# Altium schematic sheet Bank13.SchDoc
size A3; SheetNumber: 5; SheetTotal: 9
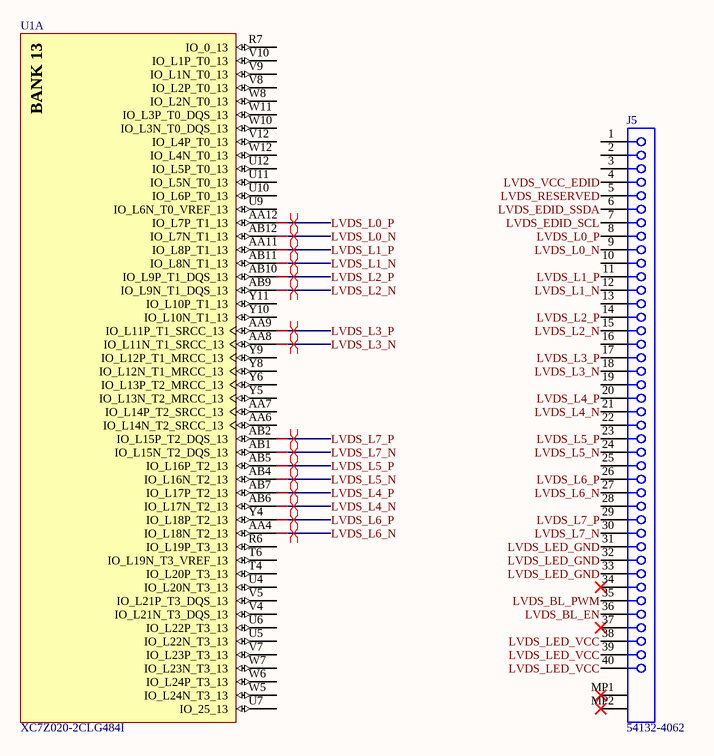
[diagram p0: Bank13.SchDoc]

## Parts
J5  54132-4062  [MOLX-54132-4062]
U1  XC7Z020-2CLG484I  [CLG484]  (part A of 10)

## Nets
LVDS_BL_EN: J5.36
LVDS_BL_PWM: J5.35
LVDS_EDID_SCL: J5.7
LVDS_EDID_SSDA: J5.6
LVDS_L0_N: J5.9 U1.AB12(IO_L7N_T1_13)
LVDS_L0_P: J5.8 U1.AA12(IO_L7P_T1_13)
LVDS_L1_N: J5.12 U1.AB11(IO_L8N_T1_13)
LVDS_L1_P: J5.11 U1.AA11(IO_L8P_T1_13)
LVDS_L2_N: J5.15 U1.AB9(IO_L9N_T1_DQS_13)
LVDS_L2_P: J5.14 U1.AB10(IO_L9P_T1_DQS_13)
LVDS_L3_N: J5.18 U1.AA8(IO_L11N_T1_SRCC_13)
LVDS_L3_P: J5.17 U1.AA9(IO_L11P_T1_SRCC_13)
LVDS_L4_N: J5.21 U1.AB6(IO_L17N_T2_13)
LVDS_L4_P: J5.20 U1.AB7(IO_L17P_T2_13)
LVDS_L5_N: J5.24 U1.AB4(IO_L16N_T2_13)
LVDS_L5_P: J5.23 U1.AB5(IO_L16P_T2_13)
LVDS_L6_N: J5.27 U1.AA4(IO_L18N_T2_13)
LVDS_L6_P: J5.26 U1.Y4(IO_L18P_T2_13)
LVDS_L7_N: J5.30 U1.AB1(IO_L15N_T2_DQS_13)
LVDS_L7_P: J5.29 U1.AB2(IO_L15P_T2_DQS_13)
LVDS_LED_GND: J5.31 J5.32 J5.33
LVDS_LED_VCC: J5.38 J5.39 J5.40
LVDS_RESERVED: J5.5
LVDS_VCC_EDID: J5.4

Not connected (* = marked no-connect by the designer): J5 1 2 3 10 13 16 19 22 25 28 34* 37* MP1* MP2*; U1 AA6(IO_L14N_T2_SRCC_13) AA7(IO_L14P_T2_SRCC_13) R6(IO_L19P_T3_13) R7(IO_0_13) T4(IO_L20P_T3_13) T6(IO_L19N_T3_VREF_13) U4(IO_L20N_T3_13) U5(IO_L22N_T3_13) U6(IO_L22P_T3_13) U7(IO_25_13) U9(IO_L6N_T0_VREF_13) U10(IO_L6P_T0_13) U11(IO_L5N_T0_13) U12(IO_L5P_T0_13) V4(IO_L21N_T3_DQS_13) V5(IO_L21P_T3_DQS_13) V7(IO_L23P_T3_13) V8(IO_L2P_T0_13) V9(IO_L1N_T0_13) V10(IO_L1P_T0_13) V12(IO_L4P_T0_13) W5(IO_L24N_T3_13) W6(IO_L24P_T3_13) W7(IO_L23N_T3_13) W8(IO_L2N_T0_13) W10(IO_L3N_T0_DQS_13) W11(IO_L3P_T0_DQS_13) W12(IO_L4N_T0_13) Y5(IO_L13N_T2_MRCC_13) Y6(IO_L13P_T2_MRCC_13) Y8(IO_L12N_T1_MRCC_13) Y9(IO_L12P_T1_MRCC_13) Y10(IO_L10N_T1_13) Y11(IO_L10P_T1_13)

## Layout directives
differential pair: LVDS_L0_N, LVDS_L0_P, LVDS_L1_N, LVDS_L1_P, LVDS_L2_N, LVDS_L2_P, LVDS_L3_N, LVDS_L3_P, LVDS_L4_N, LVDS_L4_P, LVDS_L5_N, LVDS_L5_P, LVDS_L6_N, LVDS_L6_P, LVDS_L7_N, LVDS_L7_P

## Notes on the sheet
- (in symbol CMP-0363-00013-3, part A) BANK 13

## Library data of the parts
J5 = CMP-1241-00531-1: 0.5 mm Pitch Easy-On(TM) Type FPC Connector, 2.0 mm Mated Height, Right Angle, ZIF, SMT, Bottom Contact, 40 Circuits, -20 to 85 degC, ELV and RoHS Compliant, Tape and Reel; Manufacturer: Molex; Material - Plating Termination: Gold; Stackable: No; Pitch - Mating Interface: 0.50mm; Polarized to PCB: Yes; Material - Metal: Phosphor Bronze; Durability (mating cycles max): 20; Entry Angle: 90degrees Angle; Current (Max per Contact): 0.5A; Circuits (Loaded): 40; Mated Height: 2.00mm; Voltage (Max): 50V; PartNumber: 54132-4062; PackageReference: 54132-4062; PCB Locator: No; Orientation: Right Angle; ComponentLink3URL: http://www.molex.com/pdm_docs/sd/541324062_sd.pdf; ComponentLink3Description: Package Specification; PCB Retention: Yes; ComponentLink1Description: Manufacturer URL; Number of Rows: 1; RoHS: TRUE; Contact Position: Bottom; PackageDescription: 40-Lead FPC Connector, Pitch 0.5 mm; PackageVersion: Rev. F, 07/2010; Mounting Technology: Surface Mount; ComponentLink2Description: Datasheet; ComponentLink1URL: http://www.molex.com/molex/index.jsp; Packing: Tape and Reel; Material - Plating Mating: Gold; ComponentLink2URL: http://www.molex.com/webdocs/datasheets/pdf/en-us/0541324062_FFC_FPC_CONNECTORS.pdf
U1 = CMP-0363-00013-3: 733 MHz Zynq™-7000 AP SoC, 130 PS I/O, 200 FPGA I/O, 484-Ball BGA, Speed Grade 2, Industrial Grade, Pb-Free; Speed Grade: -2; Flip Flops: 106400; LUTs: 53200; Extensible Block RAM (# 36Kb Blocks): 560 KB (140); ComponentLink3URL: http://www.xilinx.com/support/documentation/data_sheets/ds187-XC7Z010-XC7Z020-Data-Sheet.pdf; PackageReference: CLG484; Code_JEDEC: MO-275-PPAA-2; ComponentLink2URL: http://www.xilinx.com/support/documentation/user_guides/ug865-Zynq-7000-Pkg-Pinout.pdf; ComponentLink2Description: Package Specification; ComponentLink6URL: http://www.xilinx.com/support/documentation/user_guides/ug483_7Series_PCB.pdf; PackageVersion: Rev 1.1, 09/2012; DatasheetVersion: v1.2; PartNumber: XC7Z020-2CLG484I; ComponentLink3Description: DC and AC Switching Characteristics; PackageDescription: Wire-Bond Chip-Scale BGA, Body 19 x 19 mm, 0.8 mm Pitch; RoHS: Pb-Free; ComponentLink5URL: http://www.xilinx.com/support/documentation/user_guides/ug865-Zynq-7000-Pkg-Pinout.pdf; ComponentLink1URL: http://www.xilinx.com/support/documentation/data_sheets/ds190-Zynq-7000-Overview.pdf; ComponentLink4Description: Package File; Generic Part Number: XC7Z020; Mounting Technology: Surface Mount; ComponentLink1Description: Datasheet; ComponentLink4URL: http://www.xilinx.com/support/packagefiles/z7packages/xc7z020clg484pkg.txt; ComponentLink6Description: PCB and Layout Guide; ComponentLink5Description: Packaging and Pinout